# Altium schematic sheet schemetic1.SchDoc
size A; SheetNumber: 1; SheetTotal: 1
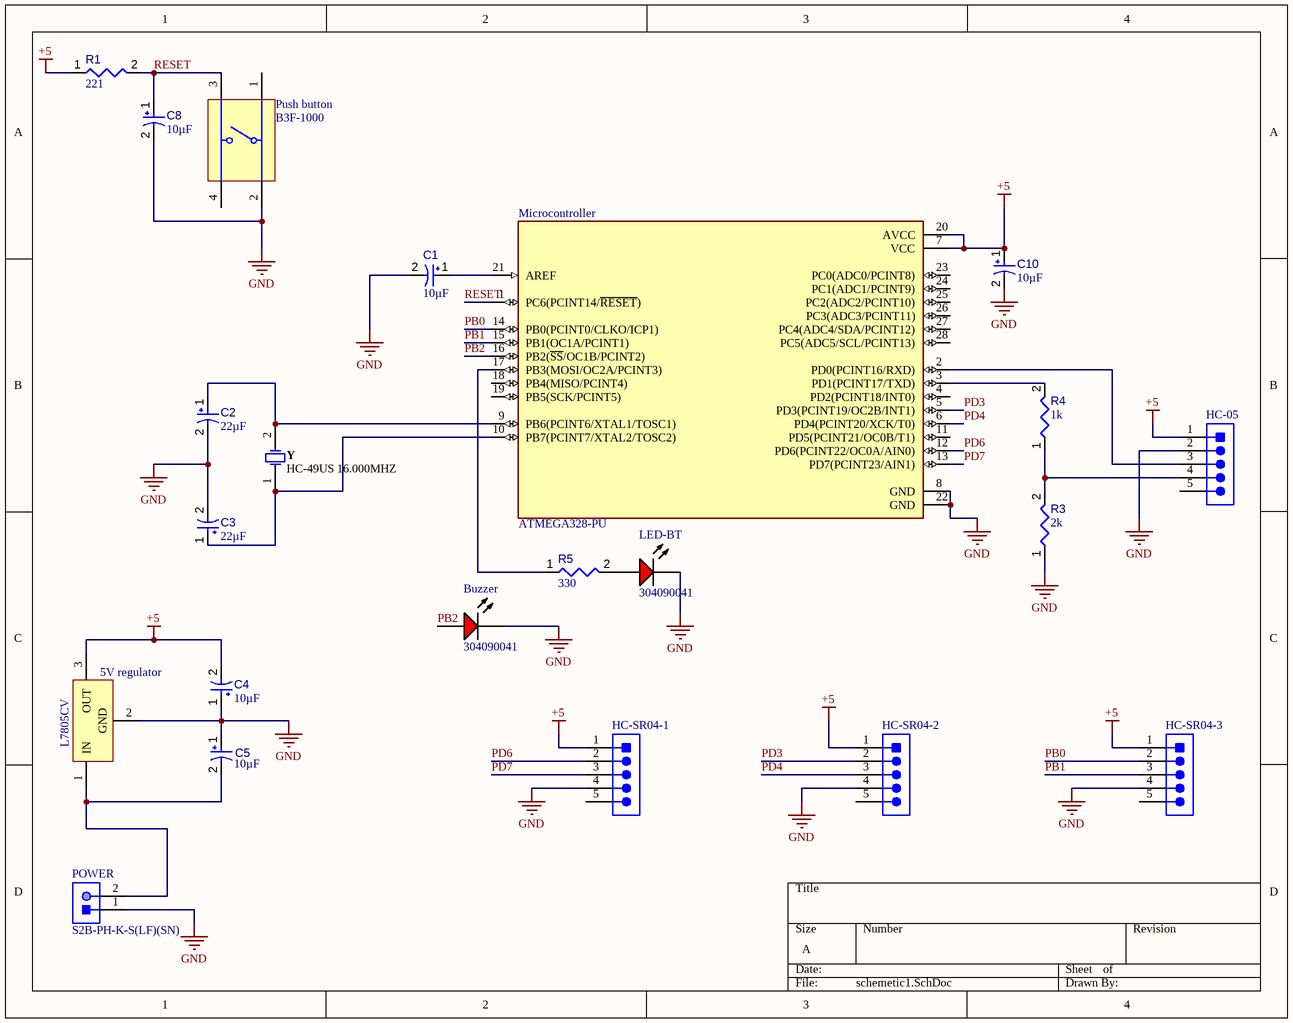
[diagram p0: schemetic1.SchDoc]

## Parts
5V_regulator  L7805CV  [TO220]
Buzzer  304090041  [LED-2P-2.28-3MM_A]
C1  value 10µF  [CAPPR55-200-1100X500X1200]  (hidden comment: ECA1HM100)
C2  value 22µF  [CAPPR55-250-1120X630X1220]  (hidden comment: ECA-2AM220)
C3  value 22µF  [CAPPR55-250-1120X630X1220]  (hidden comment: ECA-2AM220)
C4  value 10µF  [CAPPR55-200-1100X500X1200]  (hidden comment: ECA1HM100)
C5  value 10µF  [CAPPR55-200-1100X500X1200]  (hidden comment: ECA1HM100)
C8  value 10µF  [CAPPR55-200-1100X500X1200]  (hidden comment: ECA1HM100)
C10  value 10µF  [CAPPR55-200-1100X500X1200]  (hidden comment: ECA1HM100)
HC-05  77311-462K05LF  [FCI-77311-5_V]  (value not drawn)
HC-SR04-1  77311-462K05LF  [FCI-77311-5_V]  (value not drawn)
HC-SR04-2  77311-462K05LF  [FCI-77311-5_V]  (value not drawn)
HC-SR04-3  77311-462K05LF  [FCI-77311-5_V]  (value not drawn)
LED-BT  304090041  [LED-2P-2.28-3MM_A]
Microcontroller  ATMEGA328-PU  [DIP787W46P254L3467H508Q28]
POWER  S2B-PH-K-S(LF)(SN)  [JST-S2B-PH-K-S_V]
Push_button  B3F-1000  [OMRON-B3F-1000-4_V]
R1  value 221  [RESA60-630X240]  (hidden comment: MFR-25FBF52-221R)
R3  R3: 2k  [RESA60-630X240]  (hidden comment: MFR-25FBF52-1K)
R4  value 1k  [RESA60-630X240]  (hidden comment: MFR-25FBF52-1K)
R5  value 330  [RESA60-630X240]  (hidden comment: MFR-25FBF52-1K)
Y  HC-49US 16.000MHZ  [JPY-HC-49US]

## Nets
+5: 5V_regulator.3(OUT) C4.2 C10.1 HC-05.1(DTR) HC-SR04-1.1(DTR) HC-SR04-2.1(DTR) HC-SR04-3.1(DTR) Microcontroller.7(VCC) Microcontroller.20(AVCC) R1.1
GND: 5V_regulator.2(GND) Buzzer.2(K) C1.2 C2.2 C3.2 C4.1 C5.1 C8.2 C10.2 HC-05.2(RXI) HC-SR04-1.4(VCC) HC-SR04-2.4(VCC) HC-SR04-3.4(VCC) LED-BT.2(K) Microcontroller.8(GND) Microcontroller.22(GND) POWER.1 Push_button.2 R3.1
PB0: HC-SR04-3.2(RXI) Microcontroller.14(PB0(PCINT0/CLKO/ICP1))
PB1: HC-SR04-3.3(TXO) Microcontroller.15(PB1(OC1A/PCINT1))
PB2: Buzzer.1(A) Microcontroller.16(PB2(~{SS}/OC1B/PCINT2))
PD3: HC-SR04-2.2(RXI) Microcontroller.5(PD3(PCINT19/OC2B/INT1))
PD4: HC-SR04-2.3(TXO) Microcontroller.6(PD4(PCINT20/XCK/T0))
PD6: HC-SR04-1.2(RXI) Microcontroller.12(PD6(PCINT22/OC0A/AIN0))
PD7: HC-SR04-1.3(TXO) Microcontroller.13(PD7(PCINT23/AIN1))
RESET: C8.1 Microcontroller.1(PC6(PCINT14/~{RESET})) Push_button.3 R1.2
Net5V_regulator_1: 5V_regulator.1(IN) C5.2 POWER.2
NetC1_1: C1.1 Microcontroller.21(AREF)
NetC2_1: C2.1 Microcontroller.9(PB6(PCINT6/XTAL1/TOSC1)) Y.2
NetC3_1: C3.1 Microcontroller.10(PB7(PCINT7/XTAL2/TOSC2)) Y.1
NetHC-05_3: HC-05.3(TXO) Microcontroller.2(PD0(PCINT16/RXD))
NetHC-05_4: HC-05.4(VCC) R3.2 R4.1
NetLED-BT_1: LED-BT.1(A) R5.2
NetMicrocontroller_3: Microcontroller.3(PD1(PCINT17/TXD)) R4.2
NetMicrocontroller_17: Microcontroller.17(PB3(MOSI/OC2A/PCINT3)) R5.1

Not connected (* = marked no-connect by the designer): HC-05 5(CTS); HC-SR04-1 5(CTS); HC-SR04-2 5(CTS); HC-SR04-3 5(CTS); Microcontroller 4(PD2(PCINT18/INT0)) 11(PD5(PCINT21/OC0B/T1)) 18(PB4(MISO/PCINT4)) 19(PB5(SCK/PCINT5)) 23(PC0(ADC0/PCINT8)) 24(PC1(ADC1/PCINT9)) 25(PC2(ADC2/PCINT10)) 26(PC3(ADC3/PCINT11)) 27(PC4(ADC4/SDA/PCINT12)) 28(PC5(ADC5/SCL/PCINT13)); Push_button 1 4

## Library data of the parts
5V_regulator = CMP-019-00018-3: Positive Voltage Regulator IC, 1.5 A, 5 V, 0 to 125 degC, 3-Pin TO-220, RoHS, Tube; Manufacturer: STMicroelectronics; Max Input Voltage: 35V; Min Supply Voltage: 8V; Nominal Output Voltage: 5V; Outputs: 1; Output Current: 1.5A; Dropout Voltage: 2V; Max Supply Voltage: 20V; Min Input Voltage: 7V; Datasheet Version: Rev 30, 09/2012; Min Operating Temperature: 0°C; Manufacturer URL: http://www.st.com/; Pins: 3; Mounting Technology: TH; Output Voltage: 5V; RoHS Compliant: True; Max Ouput Current: 1.5A; Datasheet URL: https://datasheet.ciiva.com/15111/getdatasheetpartid-44136-15111027.pdf; Packaging: Rail/Tube; Max Operating Temperature: 125°C; Case/Package: TO-220; Package Quantity: 50
Buzzer LED-BT = CMP-007-00007-2: Red LED, 80 mW, 30 mA, -25 to 85 degC, 2-Pin THD; Manufacturer: Shenzhen CGX; Package Description: 2-Pin Through Hole Device, Dia 3 mm, Pitch 2.28 mm; Datasheet URL: http://datasheet.octopart.com/304090041-Chengguangxing-datasheet-62330656.pdf; Mounting Technology: TH; Manufacturer URL: http://szcgx.com/; RoHS Compliant: Unknown; Datasheet Version: Sep-14; Case/Package: 304090041; Package Reference: 304090041
C1 C4 C5 C8 C10 = CMP-001-00025-7: Aluminum Electrolytic Capacitor, 10 uF, +/- 20%, 50 V, -40 to 85 degC, 2-Pin THD, RoHS, Bulk; Manufacturer: Panasonic; Ripple Current (AC): 65mA; Voltage Rating: 50V; Mounting Technology: TH; RoHS Compliant: True; Capacitor Type: Electrolytic; Datasheet Version: Rev. 05, 10/2016; Min Operating Temperature: -40°C; Packaging: Bulk; Ripple Current: 65mA; Tolerance: 20%; Max Operating Temperature: 85°C; Datasheet URL: https://industrial.panasonic.com/cdbs/www-data/pdf/RDF0000/ABA0000C1218.pdf; Lead Pitch: 2mm; Pins: 2; Diameter: 5mm; Manufacturer URL: http://www.panasonic.com/; Package Reference: CAPPR55-200-1100X500X1200; Package Description: 2-Pin Radial Lead, Dia 5 mm, Height 12 mm; Case/Package: Radial; Package Quantity: 200
C2 C3 = CMP-001-00035-7: Aluminum Electrolytic Capacitor, 22 uF, +/- 20%, 100 V, -40 to 85 degC, 2-Pin THD, RoHS, Bulk; Manufacturer: Panasonic; Voltage Rating: 100V; Ripple Current: 115mA; Manufacturer URL: http://www.panasonic.com/; Packaging: Bulk; Package Description: 2-Pin Radial Lead, Dia 6.3 mm, Height 12.2 mm; Datasheet URL: https://industrial.panasonic.com/cdbs/www-data/pdf/RDF0000/ABA0000C1047.pdf; RoHS Compliant: True; Package Quantity: 200; Case/Package: Radial; Package Reference: CAPPR55-250-1120X630X1220; Datasheet Version: Mar-16; Pins: 2; Tolerance: 20%; Diameter: 6.3mm; Max Operating Temperature: 85°C; Ripple Current (AC): 115mA; Capacitor Type: Electrolytic; Mounting Technology: TH; Min Operating Temperature: -40°C; Lead Pitch: 2.5mm
HC-05 HC-SR04-1-HC-SR04-3 = CMP-002-00021-2: Male Header, Pitch 2.54 mm, 1 x 5 Position, Height 16.24 mm, Tail Length 3.05 mm, -65 to 125 degC, RoHS, Tape and Reel; Manufacturer: FCI Electronics; Connector Type: Header; Manufacturer URL: http://portal.fciconnect.com/; Datasheet URL: http://portal.fciconnect.com/Comergent//fci/drawing/77311.pdf; Gender: Male; Case/Package: 77311-5; Package Reference: 77311-5; Datasheet Version: Rev. CK, 07/2016; Package Description: Male Header, Pitch 2.54 mm, 1 x 5 Position, Height 16.24 mm, Tail Length 3.05 mm; RoHS Compliant: Unknown; Mounting Technology: TH
Microcontroller = ATMEGA328-PU: AVR AVRÂ® ATmega Microcontroller IC 8-Bit 20MHz 32KB (16K x 16) FLASH 28-PDIP; MF: Microchip; Availability: In Stock; MP: ATMEGA328-PU; SnapEDA_Link: https://www.snapeda.com/parts/ATMEGA328-PU/Microchip/view-part/?ref=snap; Value: *; Price: None; Purchase-URL: https://pricing.snapeda.com/search/part/ATMEGA328-PU/?ref=eda; Check_prices: https://www.snapeda.com/parts/ATMEGA328-PU/Microchip/view-part/?ref=eda; Package: DIP-28 Microchip Technology
POWER = CMP-002-00030-2: Male Header, Pitch 2 mm, 1 x 2 Position, Height 4.8 mm, Tail Length 3.4 mm, -25 to 85 degC, RoHS, Bulk; Manufacturer: Japan Solderless Terminals; Package Reference: S2B-PH-K-S; Case/Package: S2B-PH-K-S; Datasheet URL: http://www.jst-mfg.com/product/pdf/eng/ePH.pdf; RoHS Compliant: Unknown; Datasheet Version: Dec-12; Gender: Male; Min Operating Temperature: -25°C; Max Operating Temperature: 85°C; Package Description: Male Header, Pitch 2 mm, 1 x 2 Position, Height 4.8 mm, Tail Length 3.4 mm; Connector Type: Header; Mounting Technology: SM
Push_button = CMP-011-00004-2: Tactile Switch, SPST-NO, 0.05 A, 24 V, -25 to 70 degC, 4-Pin THD, RoHS, Bulk; Manufacturer: Omron Electronic Components; Throw Configuration: SPST; Max Contact Resistance: 100mohm; Resistance: 0.1Ohm; Max Current Rating: 50mA; Voltage Rating: 24V; Operating Force: 100gf; Datasheet Version: Jan-15; Case/Package: B3F-1000; Packaging: Bulk; Package Description: 4-Pin Through Hole Device, Body 6 x 6 mm; Manufacturer URL: http://www.omron.com/; Package Reference: B3F-1000; Contact Plating: Gold; Contact Current Rating: 50mA; RoHS Compliant: True; Contact Material: Gold; Mounting Technology: TH; Max Operating Temperature: 70°C; Min Operating Temperature: -25°C; Package Quantity: 1500; Datasheet URL: http://www.omron.com/ecb/products/pdf/en-b3f.pdf; Voltage Rating (DC): 24V; Pins: 4; Current Rating: 50mA; Max Voltage Rating (DC): 24V
R1 = CMP-009-00051-4: Axial Resistor, 221 Ohm, +/- 1%, 250 mW, -55 to 155 degC, 2-Pin THD, RoHS, Bulk; Manufacturer: Yageo; Power: 250mW; Voltage Rating: 250V; Package Quantity: 200; Manufacturer URL: http://www.yageo.com/; Case/Package: Axial; Package Reference: MFR-25; RoHS Compliant: True; Mounting Technology: TH; Datasheet URL: http://www.yageo.com/documents/recent/Yageo%20LR_MFR_2013.pdf; Packaging: Bulk; Package Description: 2-Pin Axial Lead, Dia 2.4 mm, Body Length 6.3 mm; Max Operating Temperature: 155°C; Tolerance: 1%; Datasheet Version: Apr-13; Min Operating Temperature: -55°C
R3-R5 = CMP-009-00048-4: Axial Resistor, 1 KOhm, +/- 1%, 250 mW, -55 to 155 degC, 2-Pin THD, RoHS, Bulk; Manufacturer: Yageo; Voltage Rating: 250V; Power: 250mW; Min Operating Temperature: -55°C; Max Operating Temperature: 155°C; Tolerance: 1%; Package Reference: MFR-25; Composition: CarbonFilm; Mounting Technology: TH; Packaging: Bulk; Case/Package: Axial; Datasheet URL: http://www.yageo.com/documents/recent/Yageo%20LR_MFR_2013.pdf; Package Quantity: 200; Manufacturer URL: http://www.yageo.com/; Package Description: 2-Pin Axial Lead, Dia 2.4 mm, Body Length 6.3 mm; Datasheet Version: Apr-13; RoHS Compliant: True
Y = CMP-003-00005-2: Crystal, 16 MHz, +/- 30 ppm, 18 pF, -20 to 70 degC, 2-Pin THD; Manufacturer: Jing peng yuan; Frequency: 16MHz; Package Reference: HC-49US; Case/Package: HC-49US; RoHS Compliant: Unknown; Mounting Technology: TH; Package Description: 2-Pin Throug Hole Device, Body 11.05 x 4.65 mm, Pitch 4.9 mm; Datasheet URL: https://statics3.seeedstudio.com/images/opl/datasheet/306010014.pdf; Datasheet Version: May-15